# EAGLE design bits2 (EAGLE 9.2.2)
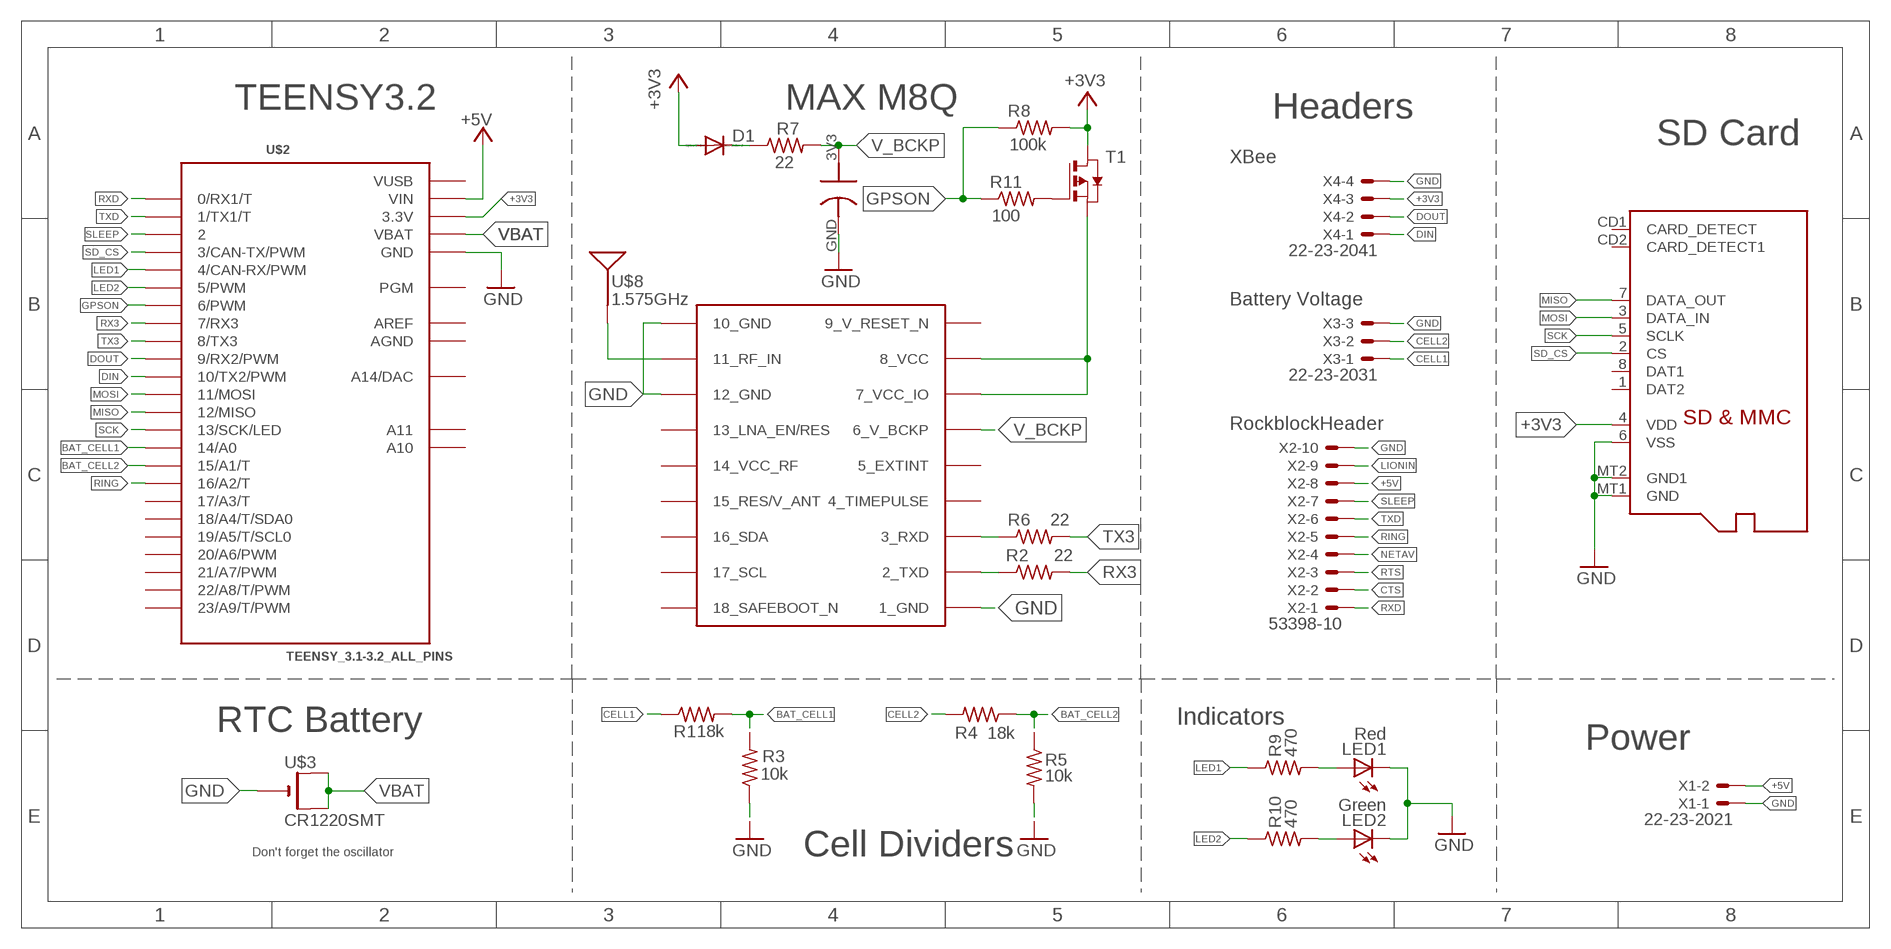
[diagram p0: schematic, sheet 1]

## Parts
C1  DCK-3R3E204T614-E  [ELNASUPERCAP]
D1  DIODE-SOD523  [SOD523]
LED1  Red  LEDCHIP-LED0603  [CHIP-LED0603]
LED2  Green  LEDCHIP-LED0603  [CHIP-LED0603]
R1  18k  R-US_R0603  [R0603]
R2  22  R-US_R0603  [R0603]
R3  10k  R-US_R0603  [R0603]
R4  18k  R-US_R0603  [R0603]
R5  10k  R-US_R0603  [R0603]
R6  22  R-US_R0603  [R0603]
R7  22  R-US_R0603  [R0603]
R8  100k  R-US_R0603  [R0603]
R9  470  R-US_R0603  [R0603]
R10  470  R-US_R0603  [R0603]
R11  100  R-US_R0603  [R0603]
T1  PMOSSOT23  [SOT-23]
U$1  MICROSD  [MICROSD]
U$2  TEENSY_3.1-3.2_ALL_PINS  [TEENSY_3.0-3.2&LC_ALL_PINS]
U$3  CR1220SMT  [CR1220-SMD]
U$7  MAX-M8  [MAX-M8]
U$8  1.575GHz  SPARKFUN-GPS_ANTENNAGPS-2X7MM  [SPARKFUN-GPS_ANT-GPS-2X7MM]
X1  22-23-2021  [22-23-2021]
X2  53398-10  [53398-10]
X3  22-23-2031  [22-23-2031]
X4  22-23-2041  [22-23-2041]

## Nets
+3V3: D1.A R8.2 T1.1(D) U$1.4(VDD) U$2.3.3V U$2.3.3V1(3.3V) X4.3
+5V: U$2.VIN X1.2 X2.8
BAT_CELL1: R1.2 R3.2 U$2.14/A0
BAT_CELL2: R4.1 R5.1 U$2.15/A1(15/A1/T)
CELL1: R1.1 X3.1
CELL2: R4.2 X3.2
CTS: X2.2
DIN: U$2.10(10/TX2/PWM) X4.1
DOUT: U$2.9(9/RX2/PWM) X4.2
GND: C1.GND LED1.C LED2.C R3.1 R5.2 U$1.6(VSS) U$1.MT1(GND) U$1.MT2(GND1) U$2.GND U$2.GND1(GND) U$3.- U$7.1_GND U$7.10_GND U$7.12_GND X1.1 X2.10 X3.3 X4.4
GPSON: R8.1 R11.1 U$2.6(6/PWM)
LED1: R9.1 U$2.4(4/CAN-RX/PWM)
LED2: R10.1 U$2.5(5/PWM)
LIONIN: X2.9
MISO: U$1.7(DATA_OUT) U$2.12(12/MISO)
MOSI: U$1.3(DATA_IN) U$2.11(11/MOSI)
N$1: U$7.11_RF_IN U$8.1(SIGNAL)
N$2: D1.C R7.1
N$3: R6.1 U$7.3_RXD
N$4: R2.1 U$7.2_TXD
N$5: LED2.A R10.2
N$6: LED1.A R9.2
N$7: R11.2 T1.3(G)
N$11: T1.2(S) U$7.7_VCC_IO U$7.8_VCC
NETAV: X2.4
RING: U$2.16/A2(16/A2/T) X2.5
RTS: X2.3
RX3: R2.2 U$2.7(7/RX3)
RXD: U$2.0(0/RX1/T) X2.1
SCK: U$1.5(SCLK) U$2.13(13/SCK/LED)
SD_CS: U$1.2(CS) U$2.3(3/CAN-TX/PWM)
SLEEP: U$2.2 X2.7
TX3: R6.2 U$2.8(8/TX3)
TXD: U$2.1(1/TX1/T) X2.6
V_BCKP: C1.3V3 R7.2 U$7.6_V_BCKP
VBAT: U$2.VBAT U$3.+$1(+) U$3.+$2(+1)
Unconnected: U$1.1(DAT2) U$1.8(DAT1) U$1.CD1(CARD_DETECT) U$1.CD2(CARD_DETECT1) U$2.17/A3(17/A3/T) U$2.18/A4(18/A4/T/SDA0) U$2.19/A5(19/A5/T/SCL0) U$2.20/A6(20/A6/PWM) U$2.21/A7(21/A7/PWM) U$2.22/A8(22/A8/T/PWM) U$2.23/A9(23/A9/T/PWM) U$2.A10 U$2.A11 U$2.PGM U$2.RESET/DAC(A14/DAC) U$7.4_TIMEPULSE U$7.5_EXTINT U$7.13_LNA_EN(13_LNA_EN/RES) U$7.14_VCC_RF U$7.15_V_ANT/RESERVED(15_RES/V_ANT) U$7.16_SDA U$7.17_SCL U$7.18_SAFEBOOT_N

## Notes on the sheet
- TEENSY3.2 | MAX M8Q | Headers
- SD Card
- XBee
- Battery Voltage
- RockblockHeader
- RTC Battery | Indicators
- Power
- Don't forget the oscillator | Cell Dividers

## Power pins joined to a net without a drawn wire
9_V_RESET_N: U$7.9_RESET_N(9_V_RESET_N)
AGND: U$2.AGND
AREF: U$2.AREF
VUSB: U$2.VUSB

## Library data of the parts
C1 = jmolterLib:DCK-3R3E204T614-E: ELNA Supercapacitor 3.3V max DCK-3R3E204T614-E 0.2F DCK-3R3E404T614-E 0.4F
D1 = diode:DIODE-: DIODE
LED1 LED2 = led:LED: LED OSRAM: - CHIPLED LG R971, LG N971, LY N971, LG Q971, LY Q971, LO R971, LY R971 LH N974, LH R974 LS Q976, LO Q976, LY Q976 LO Q996 - Hyper CHIPLED LW Q18S LB Q993, LB Q99A, LB R99A - SideLED LS A670, LO A670, LY A670, LG A670, LP A670 LB A673, LV A673, LT A673, LW A673 LH A674 LY A675 LS A676, LA A676, LO A676, LY A676, LW A676 LS A679, LY A679, LG A679 - Hyper Micro SIDELED® LS Y876, LA Y876, LO Y876, LY Y876 LT Y87S - SmartLED LW L88C, LW L88S LB L89C, LB L89S, LG L890 LS L89K, LO L89K, LY L89K LS L896, LA L896, LO L896, LY L896 - TOPLED LS T670, LO T670, LY T670, LG T670, LP T670 LSG T670, LSP T670, LSY T670, LOP T670, LYG T670 LG T671, LOG T671, LSG T671 LB T673, LV T673, LT T673, LW T673 LH T674 LS T676, LA T676, LO T676, LY T676, LB T676, LH T676, LSB T676, LW T676 LB T67C, LV T67C, LT T67C, LS T67K, LO T67K, LY T67K, LW E67C LS E67B, LA E67B, LO E67B, LY E67B, LB E67C, LV E67C, LT E67C LW T67C LS T679, LY T679, LG T679 LS T770, LO T770, LY T770, LG T770, LP T770 LB T773, LV T773, LT T773, LW T773 LH T774 LS E675, LA E675, LY E675, LS T675 LS T776, LA T776, LO T776, LY T776, LB T776 LHGB T686 LT T68C, LB T68C - Hyper Mini TOPLED® LB M676 - Mini TOPLED Santana® LG M470 LS M47K, LO M47K, LY M47K Source: http://www.osram.convergy.de LUXEON: - LUMILED® LXK2-PW12-R00, LXK2-PW12-S00, LXK2-PW14-U00, LXK2-PW14-V00 LXK2-PM12-R00, LXK2-PM12-S00, LXK2-PM14-U00 LXK2-PE12-Q00, LXK2-PE12-R00, LXK2-PE12-S00, LXK2-PE14-T00, LXK2-PE14-U00 LXK2-PB12-K00, LXK2-PB12-L00, LXK2-PB12-M00, LXK2-PB14-N00, LXK2-PB14-P00, LXK2-PB14-Q00 LXK2-PR12-L00, LXK2-PR12-M00, LXK2-PR14-Q00, LXK2-PR14-R00 LXK2-PD12-Q00, LXK2-PD12-R00, LXK2-PD12-S00 LXK2-PH12-R00, LXK2-PH12-S00 LXK2-PL12-P00, LXK2-PL12-Q00, LXK2-PL12-R00 Source: www.luxeon.com KINGBRIGHT: KA-3528ASYC Source: www.kingbright.com
R1 R3-R5 R9 R10 = resistor:R-US_: RESISTOR, American symbol
R2 R6-R8 R11 = rcl:R-US_: RESISTOR, American symbol; SPICEPREFIX: R
T1 = zetex:PMOSSOT23: MOS FET; OC_FARNELL: unknown; OC_NEWARK: unknown
U$1 = adafruit:MICROSD: Micro-SD / Transflash card holder with SPI pinout For the 3M # 2908-05WB-MG and/or 4UCON #19656 push-push type
U$2 = Teensy_3_and_LC_Series_Boards_v1.4:TEENSY_3.1-3.2_ALL_PINS: Footprint for Teensy 3.1 or 3.2 board using all through-holes, i.e. the entire perimeter plus the 4 through-holes inboard (A10,A11,AREF, VUSB)
U$3 = adafruit:CR1220: CR1216/CR1220/CR1225 12mm 3V lithium coin cell Great for battery packup. Both SMT and THM holders. Note the THM package has the ground pads on both sides of the PCB so that the masks are the same - this reduces the cost
U$7 = ubloxLib:MAX-M8: u-blox MAX GNSS module
U$8 = Tracksoar v2 :SPARKFUN-GPS_ANTENNA: Single-ended Antennae 1.575GHz antennae with just one terminal. These are all chip antennae. 1575MHz (GPS) Antennae ANT-GPS-2X7MM - 2.0 x 7.0 mm chip antenna. (SparkFun Product <https://www.sparkfun.com/products/9131>) ANT-GPS-2X8MM - 2.0 x 8.0 mm chip antenna. (SparkFun Product <https://www.sparkfun.com/products/8418>); PROD_ID: ANT-09087; SF_ID: GPS-09131
X1 = con-molex:22-23-2021: .100" (2.54mm) Center Header - 2 Pin; MF: MOLEX; MPN: 22-23-2021; OC_FARNELL: 1462926; OC_NEWARK: 25C3832
X2 = con-molex:53?-10: CONNECTOR wire to board 1.25 mm (.049 inch) pitch header; MF: MOLEX; MPN: 53398-1071; OC_FARNELL: unknown; OC_NEWARK: 59J0425
X3 = con-molex:22-23-2031: .100" (2.54mm) Center Header - 3 Pin; MF: MOLEX; MPN: 22-23-2031; OC_FARNELL: 1462950; OC_NEWARK: 30C0862
X4 = con-molex:22-23-2041: .100" (2.54mm) Center Header - 4 Pin; MF: MOLEX; MPN: 22-23-2041; OC_FARNELL: 1462920; OC_NEWARK: 38C0355

## Board
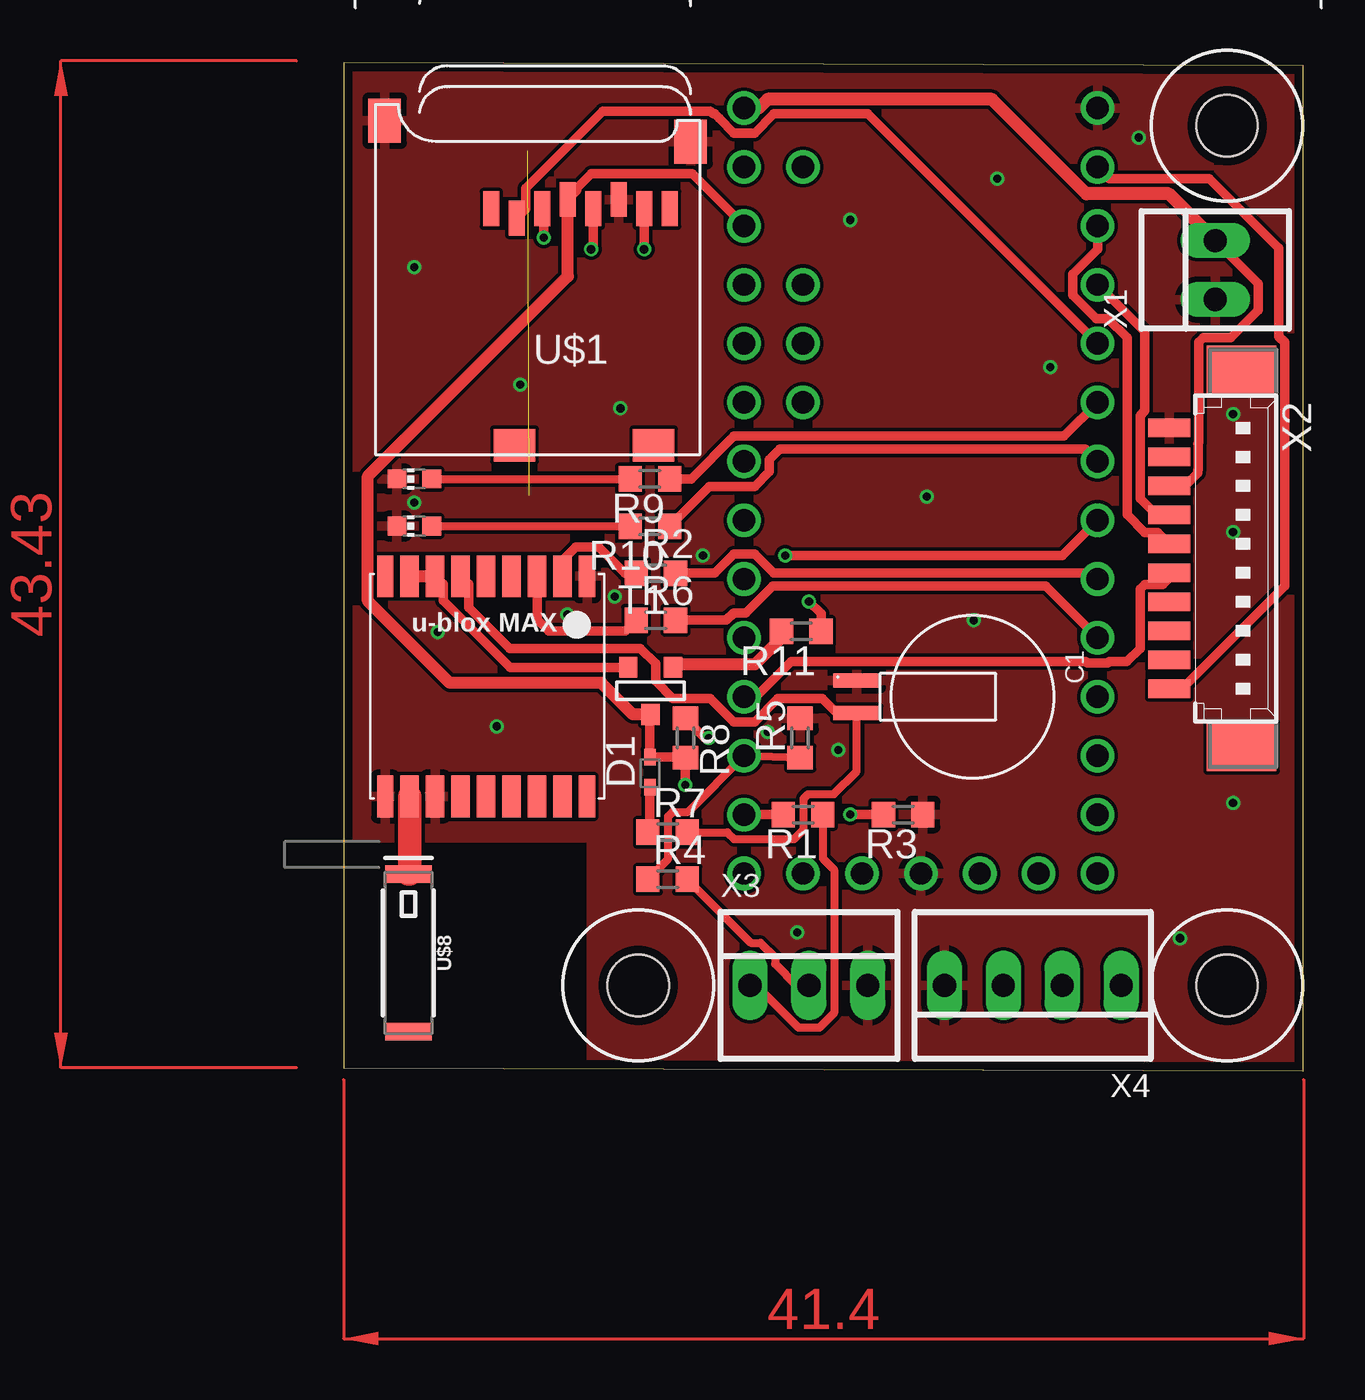
[diagram p1: board, top side]
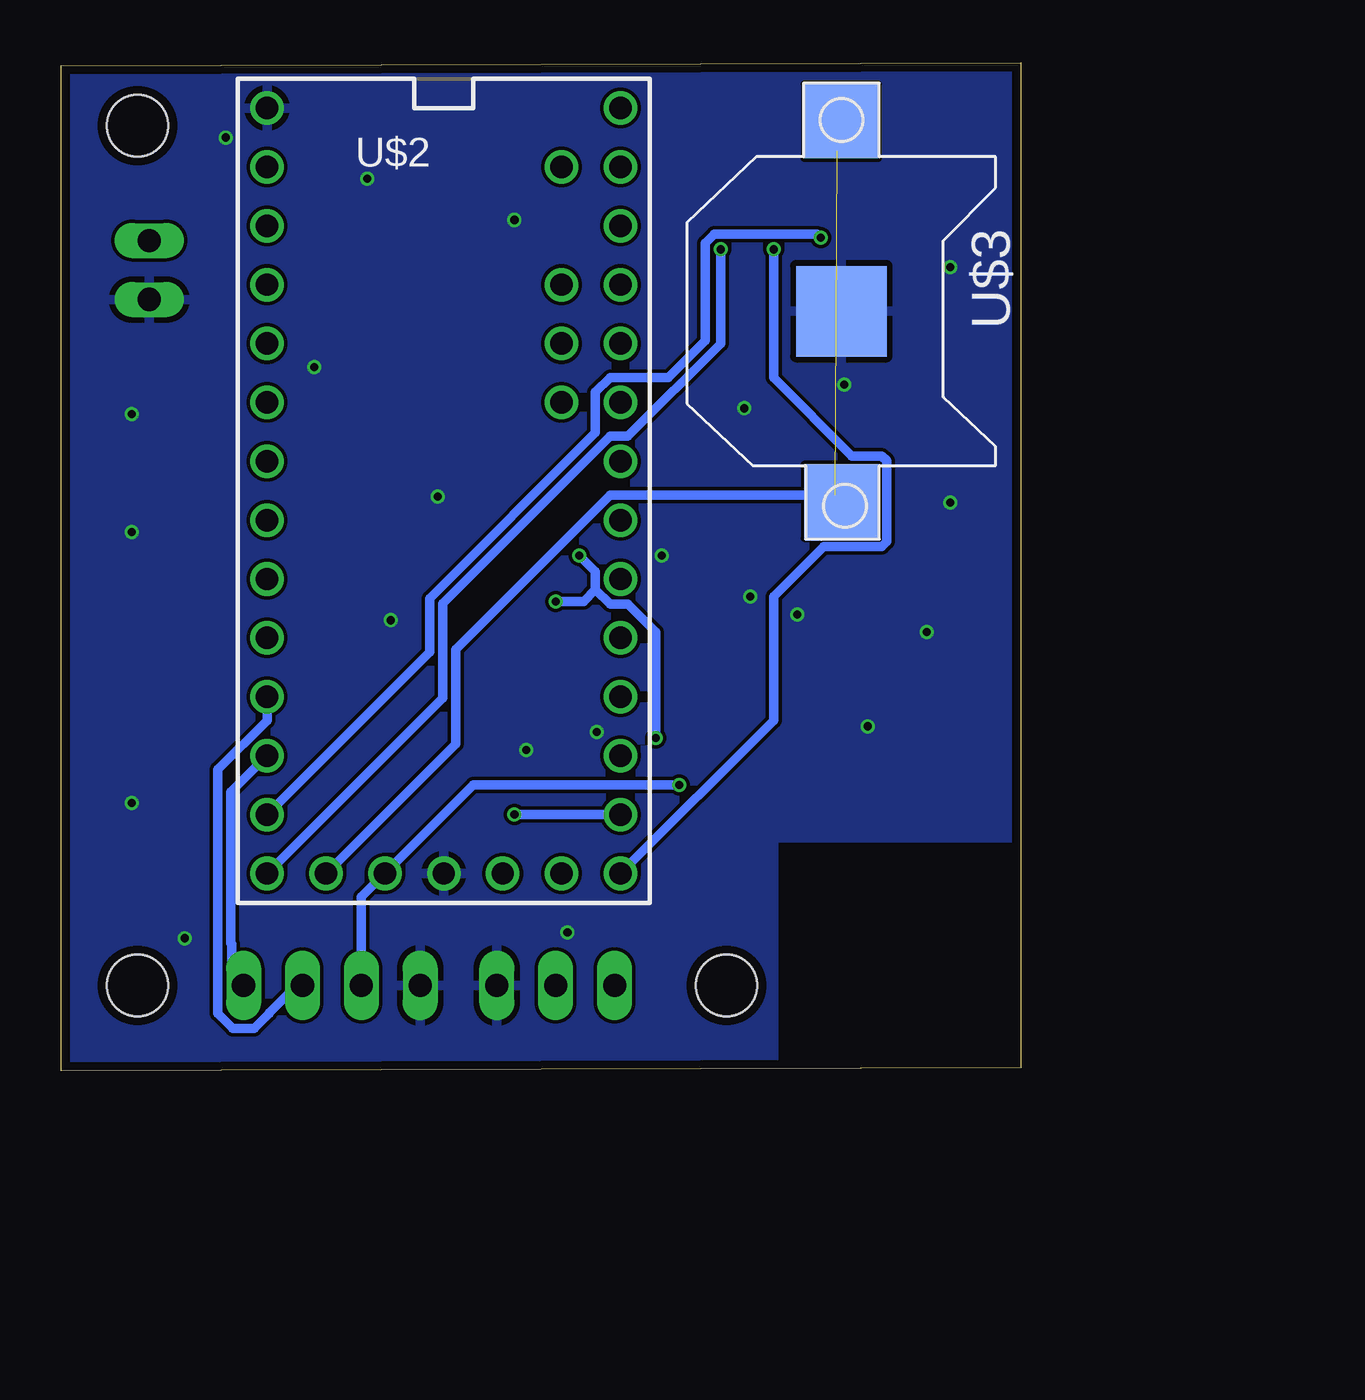
[diagram p2: board, bottom side, seen from below]

Size 41.38 x 43.48 mm. Coordinates in mm from the lower left corner, seen from the top.
Outline: 0,0.13 41.38,0 41.38,43.36 0,43.48 0,0.13
Copper layers (1*16): Top 0.035559375mm / dielectric 1.6mm / Bottom 0.035559375mm
Design rules "oshpark-2layer": minimum track width 6mil, minimum drill 10mil, track to track 6mil, track to pad 6mil, pad to pad 6mil, via to via 6mil, smd to smd 6mil, copper to edge 15mil, drill to drill 6mil, minimum pad ring 5mil, minimum via ring 5mil, stop-mask expansion 2.5mil, vias tented up to drill 0mil, thermal gap 10mil
Holes 2.65 mm at 38.1,40.77 12.7,3.68 38.1,3.68

### Footprints (pad centres in the part's own frame; a part is rotated, then mirrored left to right if it is on the bottom)
ELNASUPERCAP = smd 0.6 x 2: 3V3 0.7,-1.5; GND -0.7,-1.5
SOD523 = smd 0.7 x 0.5: A 0.7,0; C -0.6,0
CHIP-LED0603 = smd 0.8 x 0.8: A 0,-0.75; C 0,0.75
R0603 = smd 1 x 1.1: 1 -0.85,0; 2 0.85,0
SOT-23 = smd 0.787 x 0.889: 1 0.025,-1.016; 2 -0.94,1.016; 3 0.991,1.016
MICROSD = smd 0.7 x 1.5: 1 9,-10.64; 2 7.9,-10.24; 3 6.8,-10.64; 4 5.7,-11.04; 5 4.6,-10.64; 6 3.5,-11.04; 7 2.4,-10.64; 8 1.3,-10.64 | smd 1.8 x 1.4: CD1 2,-0.44; CD2 8,-0.44 | smd 1.4 x 1.9: MT1 0.4,-13.54; MT2 13.6,-14.44
TEENSY_3.0-3.2&LC_ALL_PINS = drill 0.965: 0 -7.62,13.97; 1 -7.62,11.43; 2 -7.62,8.89; 3 -7.62,6.35; 3.3V 7.62,11.43; 3.3V1 -2.54,-16.51; 4 -7.62,3.81; 5 -7.62,1.27; 6 -7.62,-1.27; 7 -7.62,-3.81; 8 -7.62,-6.35; 9 -7.62,-8.89; 10 -7.62,-11.43; 11 -7.62,-13.97; 12 -7.62,-16.51; 13 7.62,-16.51; 14/A0 7.62,-13.97; 15/A1 7.62,-11.43; 16/A2 7.62,-8.89; 17/A3 7.62,-6.35; 18/A4 7.62,-3.81; 19/A5 7.62,-1.27; 20/A6 7.62,1.27; 21/A7 7.62,3.81; 22/A8 7.62,6.35; 23/A9 7.62,8.89; A10 5.08,6.35; A11 5.08,3.81; AGND 7.62,13.97; AREF 5.08,8.89; GND -7.62,16.51; GND1 0,-16.51; PGM 2.54,-16.51; RESET/DAC 5.08,-16.51; VBAT -5.08,-16.51; VIN 7.62,16.51; VUSB 5.08,13.97
CR1220-SMD = smd 3.2 x 3.2: +$1 -8.2,0; +$2 8.2,0 | smd 3.9 x 3.9: - 0,0
MAX-M8 = smd 1.8 x 0.7: 1_GND 4.95,-4.4; 9_RESET_N 4.95,4.3; 10_GND -4.55,4.3; 18_SAFEBOOT_N -4.55,-4.4 | smd 1.8 x 0.8: 2_TXD 4.95,-3.35; 3_RXD 4.95,-2.25; 4_TIMEPULSE 4.95,-1.15; 5_EXTINT 4.95,-0.05; 6_V_BCKP 4.95,1.05; 7_VCC_IO 4.95,2.15; 8_VCC 4.95,3.25; 11_RF_IN -4.55,3.25; 12_GND -4.55,2.15; 13_LNA_EN -4.55,1.05; 14_VCC_RF -4.55,-0.05; 15_V_ANT/RESERVED -4.55,-1.15; 16_SDA -4.55,-2.25; 17_SCL -4.55,-3.35
SPARKFUN-GPS_ANT-GPS-2X7MM = smd 0.75 x 2: 1 -3.4,0; NC 3.4,0
22-23-2021 = drill 1 long: 1 -1.27,0; 2 1.27,0
53398-10 = smd 0.8 x 1.8: 1 5.625,-2.5; 2 4.375,-2.5; 3 3.125,-2.5; 4 1.875,-2.5; 5 0.625,-2.5; 6 -0.625,-2.5; 7 -1.875,-2.5; 8 -3.125,-2.5; 9 -4.375,-2.5; 10 -5.625,-2.5 | smd 2.1 x 3: S1 8.125,0.625; S2 -8.125,0.625
22-23-2031 = drill 1 long: 1 -2.54,0; 2 0,0; 3 2.54,0
22-23-2041 = drill 1 long: 1 -3.81,0; 2 -1.27,0; 3 1.27,0; 4 3.81,0

### Placement (x,y rotation side)
C1  23.62,16.13 270 top
D1  13.21,12.83 90 top
LED1  3.05,25.53 90 top
LED2  3.05,23.49 90 top
R1  19.81,11.05 180 top
R2  13.46,21.46 0 top
R3  24.13,11.05 180 top
R4  13.97,8.26 0 top
R5  19.68,14.35 90 top
R6  13.46,19.43 0 top
R7  13.97,10.29 0 top
R8  14.73,14.35 270 top
R9  13.21,25.53 180 top
R10  13.21,23.49 180 top
R11  19.74,18.95 180 top
T1  13.21,16.38 0 top
U$1  15.37,26.54 180 top
U$2  24.89,25.02 0 bottom
U$3  7.75,32.77 270 bottom
U$7  6.1,16.38 90 top
U$8  2.79,5.08 270 top
X1  37.59,34.54 90 top
X2  38.1,22.1 270 top
X3  20.07,3.68 0 top
X4  29.72,3.68 180 top

### Tracks (layer width: path | path; a pad name or v marks a point on that pad's centre or on a via)
+3V3  (via drill 0.35)
  Top 0.254: U$1.4 9.67,37.46
  Top 0.406: T1.1 13.21,15.34 D1.A 14.71,13.53 R8.2 v14.73,12.32 | U$1.4 10.06,37.98 10.06,38.08 10.67,38.69 15.03,38.69 U$2.3.3V
  Top 0.508: T1.1 12.47,15.37 11.11,16.73 4.58,16.73 1.04,20.26 1.04,25.64 9.67,34.27 9.67,37.46
  Bottom 0.406: v14.73,12.32 23.62,12.32 U$2.3.3V1 28.45,7.49 X4.3
+5V
  Top 0.406: X2.8 36.27,25.22 36.83,25.78 36.83,25.9 36.86,25.93 36.86,27.02 36.83,27.05 36.87,27.09 36.87,31.42 37.08,31.63 38.26,31.63 39.45,32.82 39.45,33.96 X1.2
  Top 0.559: U$2.VIN 17.9,41.53 18.28,41.91 27.96,41.91 32.03,37.83 35.57,37.83 X1.2
BAT_CELL1  (via drill 0.35)
  Top 0.406: v21.84,11.05 R3.2 | U$2.14/A0 R1.2
  Bottom 0.406: U$2.14/A0 v21.84,11.05
BAT_CELL2
  Top 0.356: R4.1 13.99,9.12 13.99,10.97 14.18,11.17 14.85,11.17 U$2.15/A1 R5.1
CELL1
  Top 0.356: R1.1 20.66,9.15 21.15,8.67 21.15,2.49 20.51,1.85 19.62,1.85 17.79,3.68 X3.1
CELL2
  Top 0.356: X3.2 19.52,3.68 18.61,4.6 18.61,4.88 17.97,5.51 17.56,5.51 R4.2
DIN
  Bottom 0.406: U$2.10 34.08,12.03 34.08,5.5 34.04,5.46 34.04,4.19 X4.1
DOUT
  Bottom 0.406: U$2.9 32.51,15.12 34.63,12.99 34.63,2.47 33.99,1.83 33.07,1.83 32.42,2.47 32.42,2.5 31.24,3.68 X4.2
GND  (via drill 0.35)
  other vias: 19.56,5.97 9.65,19.68 38.35,23.24 28.19,38.48 11.94,28.57 3.05,24.51 6.6,14.86 15.49,22.23 18.29,14.6 11.68,20.45 25.15,24.76 21.34,13.84 4.06,18.92 7.62,29.59 27.18,19.43 36.07,5.71 38.35,11.56 38.35,28.32 21.84,36.7 34.29,40.26 3.05,34.67 30.48,30.35
  pour Top: -1.78,44.57 -1.78,10.03 10.67,10.03 10.67,-0.64 42.67,-0.64 42.67,45.08
  pour Bottom: -1.02,44.32 -1.02,10.03 10.67,10.03 10.67,-0.38 41.91,-0.38 41.91,44.32
GPSON  (via drill 0.35)
  Top 0.406: v19.05,22.23 30.99,22.23 U$2.6 | v15.75,14.35 15.58,14.35 R8.1 | v20.07,20.25 20.59,19.73 R11.1
  Bottom 0.406: v15.75,14.35 15.75,18.92 16.95,20.13 17.72,20.13 18.35,20.76 | 18.35,20.76 18.35,21.53 v19.05,22.23 | v20.07,20.25 18.87,20.25 18.35,20.76
LED1
  Top 0.406: R9.1 14.98,25.53 16.82,27.37 31.05,27.37 U$2.4
LED2
  Top 0.406: R10.1 15.77,25.21 17.72,25.21 18.35,25.84 18.35,26.37 18.8,26.81 31.99,26.81 U$2.5
MISO  (via drill 0.35)
  Top 0.152: 12.97,36.94 U$1.7
  Top 0.406: v12.95,35.43 v12.97,35.45 12.97,36.94
  Bottom 0.406: U$2.12 24.94,16.08 24.94,20.15 17.72,27.37 16.95,27.37 12.95,31.37 v12.95,35.43
MOSI  (via drill 0.35)
  Top 0.406: v8.64,35.94 8.64,37.11 U$1.3
  Bottom 0.406: U$2.11 25.5,18.06 25.5,20.38 18.35,27.53 18.35,29.28 17.72,29.91 15.2,29.91 13.61,31.5 13.61,35.7 13.23,36.09 8.79,36.09 v8.64,35.94
N$1
  Top 1.016: U$7.11_RF_IN 2.85,8.48 U$8.1
N$2
  Top 0.406: D1.C 13.21,10.37 R7.1
N$3
  Top 0.406: R6.1 12.14,18.96 8.85,18.96 8.35,19.47 U$7.3_RXD
N$4
  Top 0.406: R2.1 12.12,21.46 10.99,22.59 10,22.59 9.4,21.99 9.4,21.38 U$7.2_TXD
N$5
  Top 0.356: LED2.A R10.2
N$6
  Top 0.356: LED1.A R9.2
N$7
  Top 0.508: T1.3 14.34,17.54 17.74,17.54 18.89,18.68 R11.2
N$11
  Top 0.406: U$7.7_VCC_IO 4.29,20.99 4.29,20.29 7.18,17.4 T1.2
  Top 0.508: U$7.8_VCC U$7.7_VCC_IO
RING
  Top 0.406: X2.5 35.6,21.25 35.33,20.98 34.55,20.98 34.34,20.77 34.34,18.21 33.78,17.65 33.02,17.65 32.96,17.59 32.06,17.59 32,17.65 19.3,17.65 17.78,16.13 U$2.16/A2
RX3
  Top 0.406: U$2.7 32.26,21.46 18.54,21.46 17.72,22.29 16.82,22.29 16,21.46 R2.2
RXD
  Top 0.406: U$2.0 33.02,38.48 37.34,38.48 40.33,35.49 40.33,31.67 40.58,31.42 40.58,20.9 36.15,16.47 X2.1
SCK  (via drill 0.35)
  Top 0.406: v10.67,35.43 10.77,35.53 U$1.5
  Bottom 0.406: U$2.13 10.67,15.11 10.67,20.45 8.5,22.61 6,22.61 5.79,22.82 5.79,26.31 6,26.52 7.29,26.52 10.67,29.9 v10.67,35.43
SD_CS
  Top 0.406: U$1.2 7.86,37.18 7.86,38.08 11.17,41.39 15.81,41.39 15.93,41.27 16,41.27 16.19,41.09 16.19,41.08 16.82,40.45 17.72,40.45 18.54,41.27 22.61,41.27 U$2.3
SLEEP
  Top 0.406: X2.7 35.57,24 35.02,24 34.34,24.68 34.34,28.27 34.54,28.47 34.54,31.88 U$2.2
TX3
  Top 0.406: R6.2 16.51,19.43 16.82,19.75 17.34,19.75 18.49,20.9 30.28,20.9 U$2.8
TXD
  Top 0.406: X2.6 35.11,23.22 34.55,23.22 33.79,23.98 33.79,31.62 32.96,32.45 32.45,32.45 31.43,33.46 31.43,34.36 32.51,35.44 U$2.1
V_BCKP
  Top 0.356: R7.2 16.54,10.29 16.84,9.99 19.43,9.99 19.83,10.4 19.83,11.74 20.02,11.93 21.14,11.93 22.12,12.91 C1.3V3
  Top 0.406: U$7.6_V_BCKP 5.39,20.99 5.39,19.98 7.16,18.21 12.8,18.21 13.45,17.56 13.45,16.81 14.2,16.06 15.82,16.06 16.82,15.05 17.72,15.05 18.73,16.06 20.65,16.06 21.34,15.37 22.06,15.37 C1.3V3
VBAT  (1 unrouted)
  Bottom 0.152: 7.93,39.7 U$3.+$1
  Bottom 0.406: U$2.VBAT 24.38,14.1 24.38,18.16 17.72,24.83 8.01,24.83 U$3.+$2
(copper drawn outside any net)
  shapes: Top area x2